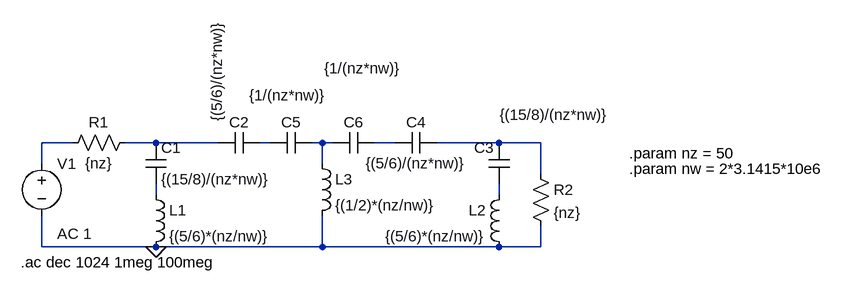
[diagram p0: schematic mariano.asc]
mariano.asc, the LTspice schematic file:
Version 4
SHEET 1 1212 680
WIRE 16 96 -32 96
WIRE 144 96 96 96
WIRE 240 96 144 96
WIRE 320 96 304 96
WIRE 400 96 384 96
WIRE 416 96 400 96
WIRE 512 96 480 96
WIRE 672 96 576 96
WIRE 736 96 672 96
WIRE -32 128 -32 96
WIRE 400 128 400 96
WIRE 736 144 736 96
WIRE 144 176 144 160
WIRE 672 176 672 160
WIRE -32 256 -32 208
WIRE 144 256 -32 256
WIRE 400 256 400 208
WIRE 400 256 144 256
WIRE 672 256 400 256
WIRE 736 256 736 224
WIRE 736 256 672 256
FLAG 144 256 0
SYMBOL voltage -32 112 R0
WINDOW 123 24 124 Left 2
WINDOW 39 0 0 Left 0
SYMATTR Value2 AC 1
SYMATTR InstName V1
SYMATTR Value ""
SYMBOL cap 128 96 R0
SYMATTR InstName C1
SYMATTR Value {(15/8)/(nz*nw)}
SYMBOL ind 128 160 R0
SYMATTR InstName L1
SYMATTR Value {(5/6)*(nz/nw)}
SYMBOL cap 304 80 R90
WINDOW 0 0 32 VBottom 2
WINDOW 3 -94 51 Top 2
SYMATTR InstName C2
SYMATTR Value {(5/6)/(nz*nw)}
SYMBOL cap 688 96 M0
WINDOW 3 15 -43 Right 2
SYMATTR InstName C3
SYMATTR Value {(15/8)/(nz*nw)}
SYMBOL ind 688 160 M0
SYMATTR InstName L2
SYMATTR Value {(5/6)*(nz/nw)}
SYMBOL cap 512 80 M90
WINDOW 0 0 32 VBottom 2
WINDOW 3 32 32 VTop 2
SYMATTR InstName C4
SYMATTR Value {(5/6)/(nz*nw)}
SYMBOL res 112 80 R90
WINDOW 0 0 56 VBottom 2
WINDOW 3 32 56 VTop 2
SYMATTR InstName R1
SYMATTR Value {nz}
SYMBOL res 720 128 R0
SYMATTR InstName R2
SYMATTR Value {nz}
SYMBOL cap 384 80 R90
WINDOW 0 0 32 VBottom 2
WINDOW 3 -73 37 VTop 2
SYMATTR InstName C5
SYMATTR Value {1/(nz*nw)}
SYMBOL cap 480 80 R90
WINDOW 0 0 32 VBottom 2
WINDOW 3 -114 18 VTop 2
SYMATTR InstName C6
SYMATTR Value {1/(nz*nw)}
SYMBOL ind 384 112 R0
SYMATTR InstName L3
SYMATTR Value {(1/2)*(nz/nw)}
TEXT -64 280 Left 2 !.ac dec 1024 1meg 100meg
TEXT 872 112 Left 2 !.param nz = 50
TEXT 872 136 Left 2 !.param nw = 2*3.1415*10e6

The netlist it stands for:
* mariano.asc
V1 N001 0 AC 1
C1 N002 N007 {(15/8)/(nz*nw)}
L1 N007 0 {(5/6)*(nz/nw)}
C2 N003 N002 {(5/6)/(nz*nw)}
C3 N006 N008 {(15/8)/(nz*nw)}
L2 N008 0 {(5/6)*(nz/nw)}
C4 N005 N006 {(5/6)/(nz*nw)}
R1 N002 N001 {nz}
R2 N006 0 {nz}
C5 N004 N003 {1/(nz*nw)}
C6 N005 N004 {1/(nz*nw)}
L3 N004 0 {(1/2)*(nz/nw)}
.ac dec 1024 1meg 100meg
.param nz = 50
.param nw = 2*3.1415*10e6
.backanno
.end